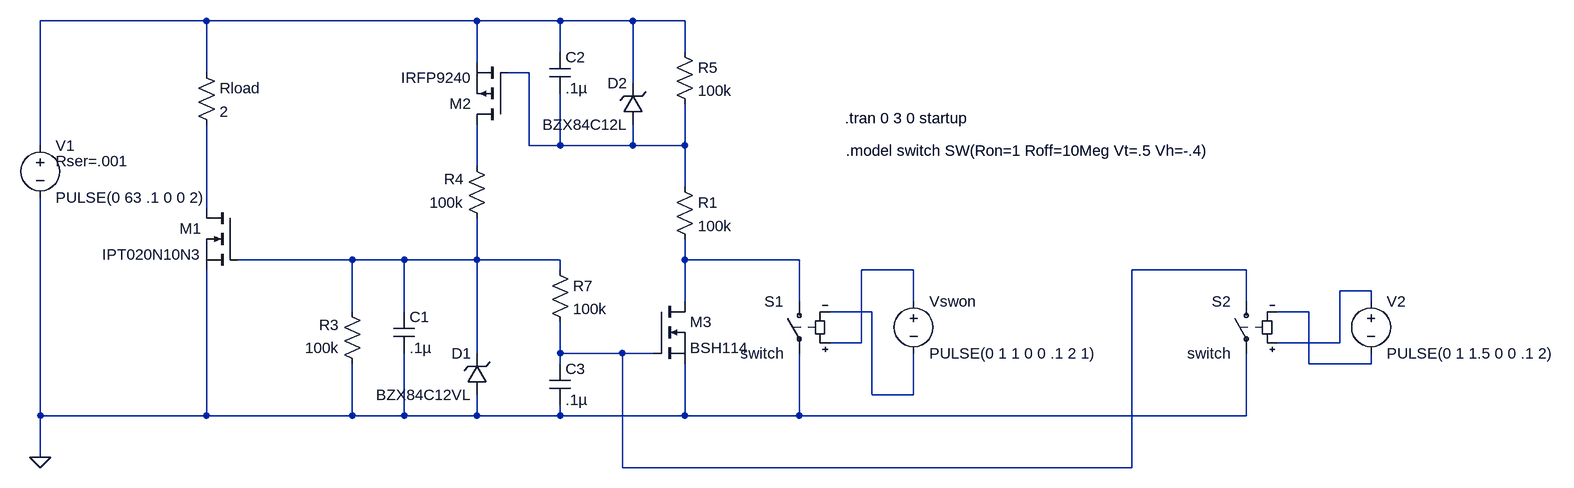
[diagram p0: schematic switch.asc]
switch.asc, the LTspice schematic file:
Version 4
SHEET 1 2060 680
WIRE 0 -448 -256 -448
WIRE 416 -448 0 -448
WIRE 544 -448 416 -448
WIRE 656 -448 544 -448
WIRE 736 -448 656 -448
WIRE 544 -400 544 -448
WIRE 736 -400 736 -448
WIRE 416 -384 416 -448
WIRE 0 -368 0 -448
WIRE 496 -368 464 -368
WIRE 656 -352 656 -448
WIRE -256 -256 -256 -448
WIRE 496 -256 496 -368
WIRE 544 -256 544 -336
WIRE 544 -256 496 -256
WIRE 656 -256 656 -288
WIRE 656 -256 544 -256
WIRE 736 -256 736 -320
WIRE 736 -256 656 -256
WIRE 416 -224 416 -288
WIRE 736 -192 736 -256
WIRE 0 -160 0 -288
WIRE 224 -80 48 -80
WIRE 304 -80 224 -80
WIRE 416 -80 416 -144
WIRE 416 -80 304 -80
WIRE 544 -80 416 -80
WIRE 736 -80 736 -112
WIRE 912 -80 736 -80
WIRE 544 -64 544 -80
WIRE 1088 -64 1008 -64
WIRE 1600 -64 1424 -64
WIRE 1792 -32 1744 -32
WIRE 736 -16 736 -80
WIRE 912 -16 912 -80
WIRE 1088 -16 1088 -64
WIRE 1600 -16 1600 -64
WIRE 1792 -16 1792 -32
WIRE 224 0 224 -80
WIRE 304 0 304 -80
WIRE 1024 0 960 0
WIRE 1696 0 1648 0
WIRE 1008 48 1008 -64
WIRE 1008 48 960 48
WIRE 1744 48 1744 -32
WIRE 1744 48 1648 48
WIRE 416 64 416 -80
WIRE 544 64 544 16
WIRE 640 64 544 64
WIRE 688 64 640 64
WIRE 544 80 544 64
WIRE 1696 80 1696 0
WIRE 1792 80 1792 64
WIRE 1792 80 1696 80
WIRE 1024 128 1024 0
WIRE 1088 128 1088 64
WIRE 1088 128 1024 128
WIRE -256 160 -256 -176
WIRE 0 160 0 -64
WIRE 0 160 -256 160
WIRE 224 160 224 80
WIRE 224 160 0 160
WIRE 304 160 304 64
WIRE 304 160 224 160
WIRE 416 160 416 128
WIRE 416 160 304 160
WIRE 544 160 544 144
WIRE 544 160 416 160
WIRE 736 160 736 80
WIRE 736 160 544 160
WIRE 912 160 912 64
WIRE 912 160 736 160
WIRE 1600 160 1600 64
WIRE 1600 160 912 160
WIRE -256 224 -256 160
WIRE 640 240 640 64
WIRE 1424 240 1424 -64
WIRE 1424 240 640 240
FLAG -256 224 0
SYMBOL nmos 48 -160 M0
SYMATTR InstName M1
SYMATTR Value IPT020N10N3
SYMBOL res 240 96 R180
WINDOW 0 36 76 Left 2
WINDOW 3 36 40 Left 2
SYMATTR InstName R3
SYMATTR Value 100k
SYMBOL res 432 -128 R180
WINDOW 0 36 76 Left 2
WINDOW 3 36 40 Left 2
SYMATTR InstName R4
SYMATTR Value 100k
SYMBOL cap 288 0 R0
SYMATTR InstName C1
SYMATTR Value .1µ
SYMBOL zener 432 128 R180
WINDOW 0 24 64 Left 2
WINDOW 3 24 0 Left 2
SYMATTR InstName D1
SYMATTR Value BZX84C12VL
SYMATTR Description Diode
SYMATTR Type diode
SYMBOL pmos 464 -288 R180
SYMATTR InstName M2
SYMATTR Value IRFP9240
SYMBOL cap 528 -400 R0
SYMATTR InstName C2
SYMATTR Value .1µ
SYMBOL zener 672 -288 R180
WINDOW 0 24 64 Left 2
WINDOW 3 24 0 Left 2
SYMATTR InstName D2
SYMATTR Value BZX84C12L
SYMATTR Description Diode
SYMATTR Type diode
SYMBOL res 720 -416 R0
SYMATTR InstName R5
SYMATTR Value 100k
SYMBOL nmos 688 -16 R0
SYMATTR InstName M3
SYMATTR Value BSH114
SYMBOL cap 528 80 R0
SYMATTR InstName C3
SYMATTR Value .1µ
SYMBOL res 528 -80 R0
SYMATTR InstName R7
SYMATTR Value 100k
SYMBOL voltage -256 -272 R0
WINDOW 123 0 0 Left 0
WINDOW 39 24 40 Left 2
SYMATTR InstName V1
SYMATTR Value PULSE(0 63 .1 0 0 2)
SYMATTR SpiceLine Rser=.001
SYMBOL res -16 -384 R0
SYMATTR InstName Rload
SYMATTR Value 2
SYMBOL res 720 -208 R0
SYMATTR InstName R1
SYMATTR Value 100k
SYMBOL sw 912 -32 M0
SYMATTR InstName S1
SYMATTR Value switch
SYMBOL voltage 1088 -32 R0
WINDOW 123 0 0 Left 0
WINDOW 39 0 0 Left 0
SYMATTR InstName Vswon
SYMATTR Value PULSE(0 1 1 0 0 .1 2 1)
SYMBOL voltage 1792 -32 R0
WINDOW 123 0 0 Left 0
WINDOW 39 0 0 Left 0
SYMATTR InstName V2
SYMATTR Value PULSE(0 1 1.5 0 0 .1 2)
SYMBOL sw 1600 -32 M0
SYMATTR InstName S2
SYMATTR Value switch
TEXT 982 -298 Left 2 !.tran 0 3 0 startup
TEXT 984 -248 Left 2 !.model switch SW(Ron=1 Roff=10Meg Vt=.5 Vh=-.4)

The netlist it stands for:
* switch.asc
M1 N004 N005 0 0 IPT020N10N3
R3 0 N005 100k
R4 N005 N003 100k
C1 N005 0 .1µ
D1 0 N005 BZX84C12VL
M2 N003 N002 N001 N001 IRFP9240
C2 N001 N002 .1µ
D2 N002 N001 BZX84C12L
R5 N001 N002 100k
M3 N006 N008 0 0 BSH114
C3 N008 0 .1µ
R7 N005 N008 100k
V1 N001 0 PULSE(0 63 .1 0 0 2) Rser=.001
Rload N001 N004 2
R1 N002 N006 100k
S1 N006 0 N007 N010 switch
Vswon N007 N010 PULSE(0 1 1 0 0 .1 2 1)
V2 N009 N011 PULSE(0 1 1.5 0 0 .1 2)
S2 N008 0 N009 N011 switch
.model D D
.lib standard.dio
.model NMOS NMOS
.model PMOS PMOS
.lib standard.mos
.tran 0 3 0 startup
.model switch SW(Ron=1 Roff=10Meg Vt=.5 Vh=-.4)
.backanno
.end